# Altium project RCB_RP2040_WWVB.PrjPcb
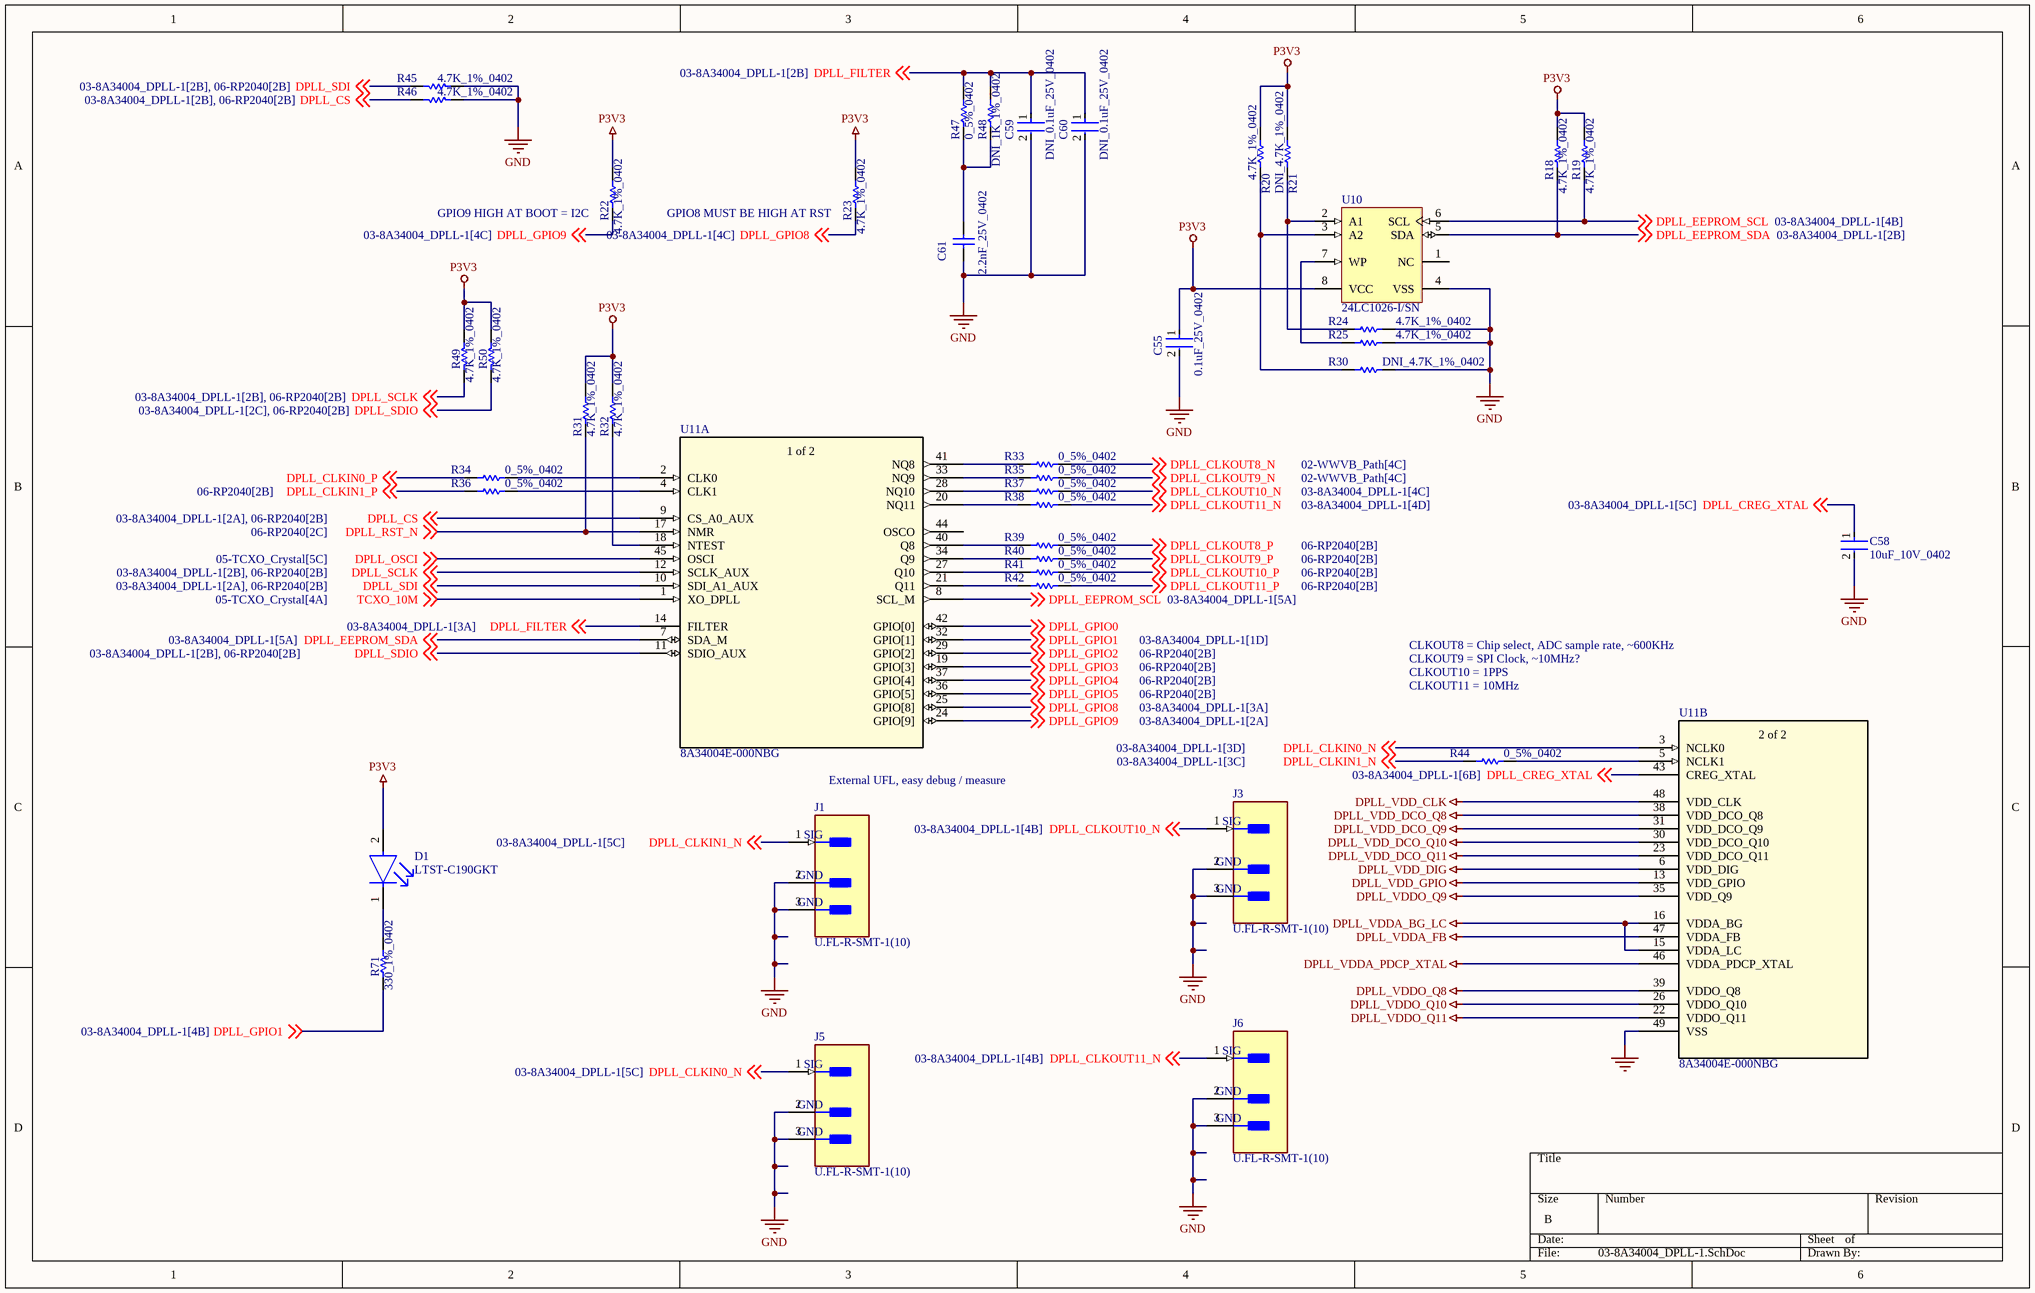
[diagram p0: 03-8A34004_DPLL-1.SchDoc]
prjCompanyName: Meta Platforms Technologies, LLC.; prjContactAddress1: 9845 Willows Road NE; prjContactAddress2: Redmond, WA 98052; prjContactEmail: Contact Email; prjContactPhone: (...)-...-....; prjElectricalEngineer: Electical Engineer; prjElectricalEngineerEmail: Electical Engineer Email; prjLayoutEngineer: Layout Engineer; prjLayoutEngineerEmail: Layout Engineer Email; prjMechanicalEngineer: Mechanical Engineer; prjMechanicalEngineerEmail: Mechanical Engineer Email; prjPCB_IPN: 844-XXXXX-XX; prjPCB_Name: PCB Name; prjPCB_Revision: X1; prjProjectName: Project Name; prjSchematic_IPN: 846-XXXXX-XX; prjSchematic_Revision: X1; XprjPCBA_IPN: Set v_prjPCBA_IPN in variant parameters; XprjPCBA_Revision: Set v_prjPCBA_Revision in variant parameters
4 sheets, 122 parts. Net scope: global (net labels, ports and power ports of the same name join across sheets).
Board file: RCB_RP2040_WWVB_V1.PcbDoc
Sheets:
  03-8A34004_DPLL-1.SchDoc
  05-TCXO_Crystal.SchDoc
  06-RP2040.SchDoc
  08-Power.SchDoc

## Sheet 03-8A34004_DPLL-1.SchDoc
size B; SheetNumber: 3; SheetTotal: 8

### Parts
C55  0.1uF_25V_0402  [FP-0402-L_1_0_1-W_0_5_0_1-IPC_C]
C58  10uF_10V_0402  [FP-CL05A106MP5NUNC-MFG]
C59  DNI_0.1uF_25V_0402  [FP-0402-L_1_0_1-W_0_5_0_1-IPC_C]  (no BOM)
C60  DNI_0.1uF_25V_0402  [FP-0402-L_1_0_1-W_0_5_0_1-IPC_C]  (no BOM)
C61  2.2nF_25V_0402  [CAPC1005X56X25LL10T15]
D1  LTST-C190GKT  [FP-LTST-C190GKT-MFG]
J1  U.FL-R-SMT-1(10)  [FP-U_FL-R-SMT-1_10-MFG]
J3  U.FL-R-SMT-1(10)  [FP-U_FL-R-SMT-1_10-MFG]
J5  U.FL-R-SMT-1(10)  [FP-U_FL-R-SMT-1_10-MFG]
J6  U.FL-R-SMT-1(10)  [FP-U_FL-R-SMT-1_10-MFG]
R18  4.7K_1%_0402  [RESC1005X40X25NL10T10]
R19  4.7K_1%_0402  [RESC1005X40X25NL10T10]
R20  4.7K_1%_0402  [RESC1005X40X25NL10T10]
R21  DNI_4.7K_1%_0402  [RESC1005X40X25NL10T10]  (no BOM)
R22  4.7K_1%_0402  [RESC1005X40X25NL10T10]
R23  4.7K_1%_0402  [RESC1005X40X25NL10T10]
R24  4.7K_1%_0402  [RESC1005X40X25NL10T10]
R25  4.7K_1%_0402  [RESC1005X40X25NL10T10]
R30  DNI_4.7K_1%_0402  [RESC1005X40X25NL10T10]  (no BOM)
R31  4.7K_1%_0402  [RESC1005X40X25NL10T10]
R32  4.7K_1%_0402  [RESC1005X40X25NL10T10]
R33  0_5%_0402  [RESC1005X40X25NL05T10]
R34  0_5%_0402  [RESC1005X40X25NL05T10]
R35  0_5%_0402  [RESC1005X40X25NL05T10]
R36  0_5%_0402  [RESC1005X40X25NL05T10]
R37  0_5%_0402  [RESC1005X40X25NL05T10]
R38  0_5%_0402  [RESC1005X40X25NL05T10]
R39  0_5%_0402  [RESC1005X40X25NL05T10]
R40  0_5%_0402  [RESC1005X40X25NL05T10]
R41  0_5%_0402  [RESC1005X40X25NL05T10]
R42  0_5%_0402  [RESC1005X40X25NL05T10]
R44  0_5%_0402  [RESC1005X40X25NL05T10]
R45  4.7K_1%_0402  [RESC1005X40X25NL10T10]
R46  4.7K_1%_0402  [RESC1005X40X25NL10T10]
R47  0_5%_0402  [RESC1005X40X25LL10T10]
R48  DNI_1K_1%_0402  [RESC1005X40X25NL05T05]  (no BOM)
R49  4.7K_1%_0402  [RESC1005X40X25NL10T10]
R50  4.7K_1%_0402  [RESC1005X40X25NL10T10]
R71  330_1%_0402  [RESC1005X40X25NL10T10]
U10  24LC1026-I/SN  [MCHP-SOIC-SN8_N]
U11  8A34004E-000NBG  [NBG48P1_REN]  (parts A,B of 2)

### Nets
DPLL_VDD_CLK: U11.48(VDD_CLK)
DPLL_VDD_DCO_Q8: U11.38(VDD_DCO_Q8)
DPLL_VDD_DCO_Q9: U11.31(VDD_DCO_Q9)
DPLL_VDD_DCO_Q10: U11.30(VDD_DCO_Q10)
DPLL_VDD_DCO_Q11: U11.23(VDD_DCO_Q11)
DPLL_VDD_DIG: U11.6(VDD_DIG)
DPLL_VDD_GPIO: U11.13(VDD_GPIO)
DPLL_VDDA_BG_LC: U11.15(VDDA_LC) U11.16(VDDA_BG)
DPLL_VDDA_FB: U11.47(VDDA_FB)
DPLL_VDDA_PDCP_XTAL: U11.46(VDDA_PDCP_XTAL)
DPLL_VDDO_Q8: U11.39(VDDO_Q8)
DPLL_VDDO_Q9: U11.35(VDD_Q9)
DPLL_VDDO_Q10: U11.26(VDDO_Q10)
DPLL_VDDO_Q11: U11.22(VDDO_Q11)
GND: C55.2 C58.2 C59.2 C60.2 C61.1 J1.2(GND) J1.3(GND) J3.2(GND) J3.3(GND) J5.2(GND) J5.3(GND) J6.2(GND) J6.3(GND) R24.1 R25.1 R30.2 R45.2 R46.2 U10.4(VSS) U11.49(VSS)
P3V3: C55.1 D1.2(A) R18.1 R19.1 R20.2 R21.2 R22.1 R23.1 R31.2 R32.2 R49.2 R50.2 U10.8(VCC)
DPLL_CLKIN0_N: J5.1(SIG) U11.3(NCLK0) ; off-sheet DPLL_CLKIN0_N
DPLL_CLKIN0_P: R34.1 ; off-sheet DPLL_CLKIN0_P
DPLL_CLKIN1_N: J1.1(SIG) R44.1 ; off-sheet DPLL_CLKIN1_N
DPLL_CLKIN1_P: R36.1 ; off-sheet DPLL_CLKIN1_P
DPLL_CLKOUT8_N: R33.2 ; off-sheet DPLL_CLKOUT8_N
DPLL_CLKOUT8_P: R39.2 ; off-sheet DPLL_CLKOUT8_P
DPLL_CLKOUT9_N: R35.2 ; off-sheet DPLL_CLKOUT9_N
DPLL_CLKOUT9_P: R40.2 ; off-sheet DPLL_CLKOUT9_P
DPLL_CLKOUT10_N: J3.1(SIG) R37.2 ; off-sheet DPLL_CLKOUT10_N
DPLL_CLKOUT10_P: R41.2 ; off-sheet DPLL_CLKOUT10_P
DPLL_CLKOUT11_N: J6.1(SIG) R38.2 ; off-sheet DPLL_CLKOUT11_N
DPLL_CLKOUT11_P: R42.2 ; off-sheet DPLL_CLKOUT11_P
DPLL_CREG_XTAL: C58.1 U11.43(CREG_XTAL) ; off-sheet DPLL_CREG_XTAL
DPLL_CS: R46.1 U11.9(CS_A0_AUX) ; off-sheet DPLL_CS
DPLL_EEPROM_SCL: R19.2 U10.6(SCL) U11.8(SCL_M) ; off-sheet DPLL_EEPROM_SCL
DPLL_EEPROM_SDA: R18.2 U10.5(SDA) U11.7(SDA_M) ; off-sheet DPLL_EEPROM_SDA
DPLL_FILTER: C59.1 C60.1 R47.2 R48.2 U11.14(FILTER) ; off-sheet DPLL_FILTER
DPLL_GPIO0: U11.42(GPIO[0]) ; off-sheet DPLL_GPIO0
DPLL_GPIO1: R71.1 U11.32(GPIO[1]) ; off-sheet DPLL_GPIO1
DPLL_GPIO2: U11.29(GPIO[2]) ; off-sheet DPLL_GPIO2
DPLL_GPIO3: U11.19(GPIO[3]) ; off-sheet DPLL_GPIO3
DPLL_GPIO4: U11.37(GPIO[4]) ; off-sheet DPLL_GPIO4
DPLL_GPIO5: U11.36(GPIO[5]) ; off-sheet DPLL_GPIO5
DPLL_GPIO8: R23.2 U11.25(GPIO[8]) ; off-sheet DPLL_GPIO8
DPLL_GPIO9: R22.2 U11.24(GPIO[9]) ; off-sheet DPLL_GPIO9
DPLL_OSCI: U11.45(OSCI) ; off-sheet DPLL_OSCI
DPLL_RST_N: R31.1 U11.17(NMR) ; off-sheet DPLL_RST_N
DPLL_SCLK: R49.1 U11.12(SCLK_AUX) ; off-sheet DPLL_SCLK
DPLL_SDI: R45.1 U11.10(SDI_A1_AUX) ; off-sheet DPLL_SDI
DPLL_SDIO: R50.1 U11.11(SDIO_AUX) ; off-sheet DPLL_SDIO
TCXO_10M: U11.1(XO_DPLL) ; off-sheet TCXO_10M
NetC61_2: C61.2 R47.1 R48.1
NetD1_1: D1.1(C) R71.2
NetR20_1: R20.1 R30.1 U10.3(A2)
NetR21_1: R21.1 R24.2 U10.2(A1)
NetR25_2: R25.2 U10.7(WP)
NetR32_1: R32.1 U11.18(NTEST)
NetR33_1: R33.1 U11.41(NQ8)
NetR34_2: R34.2 U11.2(CLK0)
NetR35_1: R35.1 U11.33(NQ9)
NetR36_2: R36.2 U11.4(CLK1)
NetR37_1: R37.1 U11.28(NQ10)
NetR38_1: R38.1 U11.20(NQ11)
NetR39_1: R39.1 U11.40(Q8)
NetR40_1: R40.1 U11.34(Q9)
NetR41_1: R41.1 U11.27(Q10)
NetR42_1: R42.1 U11.21(Q11)
NetR44_2: R44.2 U11.5(NCLK1)

Not connected (* = marked no-connect by the designer): U10 1(NC); U11 44(OSCO)

### Notes on the sheet
- (near R22) GPIO9 HIGH AT BOOT = I2C
- GPIO8 MUST BE HIGH AT RST
- CLKOUT8 = Chip select, ADC sample rate, ~600KHz
- CLKOUT9 = SPI Clock, ~10MHz?
- CLKOUT10 = 1PPS
- CLKOUT11 = 10MHz
- External UFL, easy debug / measure
- (in symbol 8A34004E-000NBG, part A) 1 of 2
- (in symbol 8A34004E-000NBG, part B) 2 of 2

### Library data of the parts
C55 C59 C60 = CMP-2008-02519-2: General Purpose Ceramic Capacitor, 0402, 100nF, 10%, X7R, 15%, 25V; Package Quantity: 1; Capacitance: 100nF; Min Operating Temperature: -55°C; Voltage: 25V; Voltage Rating: 25V; Construction: Flat; Max Operating Temperature: 125°C; Radiation Hardening: No; Depth: 0.5mm; Thickness: 0.022inch; Voltage Rating (DC): 25V; Number of Pins: 2; Lead Free: Lead Free; Series: -; REACH SVHC: No SVHC; Length: 1mm; Dielectric: X7R; RoHS Compliant: Yes; Mount: Surface Mount; Packaging: Tape and Reel; Case/Package: 0402; Case Code (Imperial): 0402; Termination: SMD/SMT; Width: 0.02inch; Case Code (Metric): 1005; Tolerance: 10%
C58 = CMP-13271-000002-1: CAP CER 10UF 10V X5R 0402; Manufacturer Part Number: CL05A106MP5NUNC; Manufacturer: Samsung; Temperature Coefficient: 15%; Tolerance: 20%; Material: Ceramic; Octopart: https://octopart.com/cl05a106mp5nunc-samsung-22457395; Voltage Rating: 10V; RoHS: TRUE; Value: 10uF; Height: 0.7mm; Digikey Description: CAP CER 10UF 10V X5R 0402; Automotive: No; Package: CL05A106MP5NUNC; Device Class L1: Passive Components; Capacitance: 10uF; Temperature Range High: +85°C; ComponentLink2Description: Datasheet; Device Class L2: Capacitors; Temperature Characteristic: X5R; Temperature: -55°C to +85°C; ComponentLink2URL: http://www.samsungsem.com/kr/support/product-search/mlcc/__icsFiles/afieldfile/2019/05/10/19-CL05A106MP5NUNC.pdf; Device Class L3: Ceramic Capacitors; Category: Cap; Temperature Range Low: -55°C; Ipc Land Pattern Name: CAPC10050X50; Lead Free: Yes
C61 = CMP-2008-02907-1: Manufacturer: AVX Interconnect / Elco; Part Number: 04025C222JAT2A
D1 = CMP-22017-000005-2: LED GREEN CLEAR CHIP SMD; Dominant Wavelength: 569nm; Reverse Voltage: 5V; Lens Color: Colorless; Viewing Angle: 130°; Voltage: 2V; Forward Current: 30mA; Power Dissipation: 100mW; Luminous Intensity: 6mcd; Number of LEDs: 1; Forward Voltage: 2.1V; Wavelength: 565nm; Test Current: 10mA; Min Operating Temperature: -55°C; Lens Style: Clear; Mount: Surface Mount; Width: 0.8mm; Packaging: Tape and Reel; Lens Transparency: Clear; Case Code (Metric): 1608; Depth: 0.8mm; Case Code (Imperial): 0603; Case/Package: 0603; Number of Pins: 2; Max Operating Temperature: 85°C; Lead Free: Lead Free; Number of Elements: 1; Length: 1.6mm; Height: 0.8mm; Package Quantity: 1; Power Rating: 100mW; Radiation Hardening: No; Illumination Color: Green; Color: Green
J1 J3 J5 J6 = CMP-2000-05152-3: CONN U.FL RCPT STR 50 OHM SMD; Max Frequency: 6GHz; Connector Type: Coaxial; Body Plating: Silver; Body Material: Bronze; Impedance: 50R; Dielectric Material: Polymer; Insulation Resistance: 500MR; Gender: Male; Packaging: Cut Tape; Length: 3mm; Package Quantity: 2500; Termination: Solder; Lead Free: Lead Free; Series: U.FL; Min Operating Temperature: -40°C; Fastening Type: Snap; Contact Material: Brass; Orientation: Straight; Wire/Cable Type: Coaxial; Frequency: 6GHz; Contact Plating: Gold; Depth: 3.1mm; Weight: 0.001764oz; Max Operating Temperature: 90°C; Radiation Hardening: No; REACH SVHC: No SVHC; Mount: Surface Mount; Housing Color: Beige
R18-R25 R30-R32 R45 R46 R49 R50 = CMP-2002-05217-1: Manufacturer: Bourns; Part Number: CR0402-FX-4701GLF
R33-R42 R44 = CMP-2002-06457-1: Manufacturer: Panasonic; Part Number: ERJ-U020R00X
R47 = CMP-2002-04569-1: Manufacturer: KOA Speer; Part Number: RK73Z1ETTP
R48 = CMP-2002-08277-1: Manufacturer: Vishay Dale; Part Number: CRCW04021K00FKTD
R71 = CMP-2002-05853-1: Manufacturer: Panasonic; Part Number: ERA-2AED331X
U10 = CMP-0159-01024-1: 1024K bits I2C™ Serial EEPROM, 2.5 to 5.5 V, 400 kHz, -40 to 85 degC, 8-pin SOIC (SN8), Tube; Manufacturer: Microchip; DatasheetVersion: Rev. C; ComponentLink3Description: Package Specification; ComponentLink1URL: http://www.microchip.com; Mounting Technology: Surface Mount; ComponentLink4URL: http://www.microchip.com/24LC1026; ComponentLink2Description: Datasheet; PartNumber: 24LC1026-I/SN; PackageReference: SOIC-SN8; PackageDescription: 8-Lead Plastic Small Outline, 4.9 x 3.9 mm Body, 1.27 mm Pitch; ComponentLink1Description: Manufacturer URL; ComponentLink3URL: http://www.microchip.com/stellent/groups/techpub_sg/documents/packagingspec/en012702.pdf; ComponentLink2URL: http://ww1.microchip.com/downloads/en/DeviceDoc/22270C.pdf; PackageVersion: C04-057C; ComponentLink4Description: Product URL
U11 = 8A34004E-000NBG: No Description Available; Mfr_Name: Renesas Electronics; RefDes: RefDes; Type: Type

## Sheet 05-TCXO_Crystal.SchDoc
size B; SheetNumber: 4; SheetTotal: 7
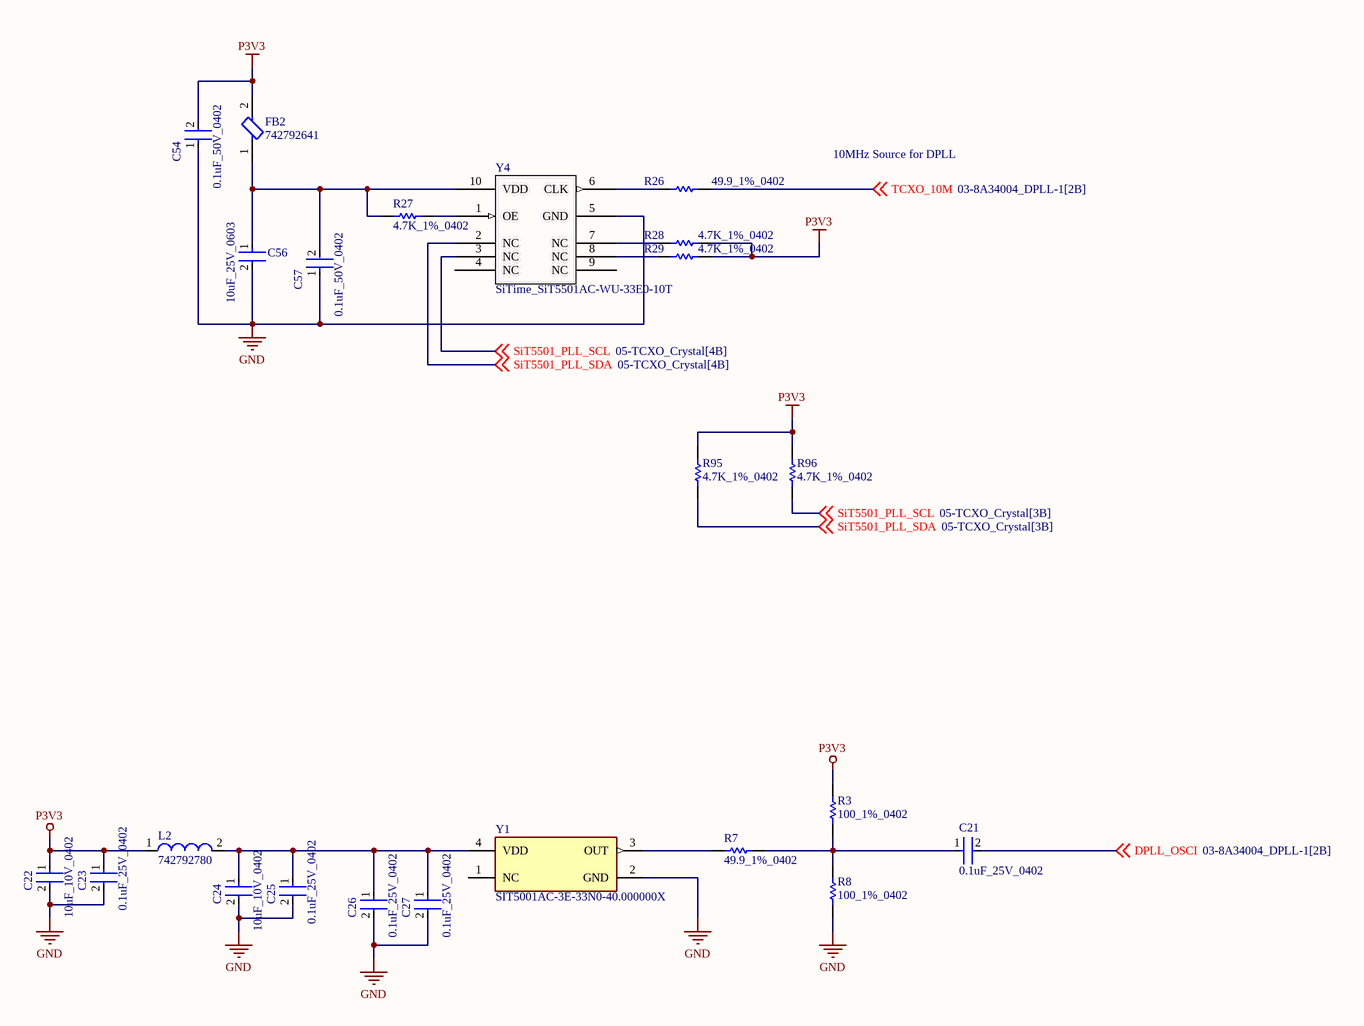
[diagram p1: 05-TCXO_Crystal.SchDoc]

### Parts
C21  0.1uF_25V_0402  [FP-0402-L_1_0_1-W_0_5_0_1-IPC_C]
C22  10uF_10V_0402  [FP-CL05A106MP5NUNC-MFG]
C23  0.1uF_25V_0402  [FP-0402-L_1_0_1-W_0_5_0_1-IPC_C]
C24  10uF_10V_0402  [FP-CL05A106MP5NUNC-MFG]
C25  0.1uF_25V_0402  [FP-0402-L_1_0_1-W_0_5_0_1-IPC_C]
C26  0.1uF_25V_0402  [FP-0402-L_1_0_1-W_0_5_0_1-IPC_C]
C27  0.1uF_25V_0402  [FP-0402-L_1_0_1-W_0_5_0_1-IPC_C]
C54  0.1uF_50V_0402  [FP-C1005-050-0_05-IPC_C]
C56  10uF_25V_0603  [FP-CL10-IPC_C]
C57  0.1uF_50V_0402  [FP-C1005-050-0_05-IPC_C]
FB2  742792641  [FP-742792641-MFG]
L2  742792780  [SMD-0402]
R3  100_1%_0402  [RESC1005X40X25ML05T10]
R7  49.9_1%_0402  [RESC1005X40X25NL10T10]
R8  100_1%_0402  [RESC1005X40X25ML05T10]
R26  49.9_1%_0402  [RESC1005X40X25NL10T10]
R27  4.7K_1%_0402  [RESC1005X40X25NL10T10]
R28  4.7K_1%_0402  [RESC1005X40X25NL10T10]
R29  4.7K_1%_0402  [RESC1005X40X25NL10T10]
R95  4.7K_1%_0402  [RESC1005X40X25NL10T10]
R96  4.7K_1%_0402  [RESC1005X40X25NL10T10]
Y1  SIT5001AC-3E-33N0-40.000000X  [FP-SiT5001-3-MFG]
Y4  SiTime_SiT5501AC-WU-33E0-10T  [SITIME_SPL-086-CQFN-010-C07050_REV_DRAFT]

### Nets
GND: C22.2 C23.2 C24.2 C25.2 C26.2 C27.2 C54.1 C56.2 C57.1 R8.1 Y1.2(GND) Y4.5(GND)
P3V3: C22.1 C23.1 C54.2 FB2.2 L2.1 R3.2 R28.2 R29.2 R95.2 R96.2
DPLL_OSCI: C21.2 ; off-sheet DPLL_OSCI
SiT5501_PLL_SCL: R96.1 Y4.3(NC) ; off-sheet SiT5501_PLL_SCL
SiT5501_PLL_SDA: R95.1 Y4.2(NC) ; off-sheet SiT5501_PLL_SDA
TCXO_10M: R26.1 ; off-sheet TCXO_10M
NetC21_1: C21.1 R3.1 R7.2 R8.2
NetC24_1: C24.1 C25.1 C26.1 C27.1 L2.2 Y1.4(VDD)
NetC56_1: C56.1 C57.2 FB2.1 R27.1 Y4.10(VDD)
NetR7_1: R7.1 Y1.3(OUT)
NetR26_2: R26.2 Y4.6(CLK)
NetR27_2: R27.2 Y4.1(OE)
NetR28_1: R28.1 Y4.7(NC)
NetR29_1: R29.1 Y4.8(NC)

Not connected (* = marked no-connect by the designer): Y1 1(NC); Y4 4(NC) 9(NC)

### Notes on the sheet
- 10MHz Source for DPLL

### Library data of the parts
C21 C23 C25-C27 = CMP-2008-02519-2: as C55 on sheet 03-8A34004_DPLL-1; Package Quantity: 1; Capacitance: 100nF; Min Operating Temperature: -55°C; Voltage: 25V; Voltage Rating: 25V; Construction: Flat; Max Operating Temperature: 125°C; Radiation Hardening: No; Depth: 0.5mm; Thickness: 0.022inch; Voltage Rating (DC): 25V; Number of Pins: 2; Lead Free: Lead Free; Series: -; REACH SVHC: No SVHC; Length: 1mm; Dielectric: X7R; RoHS Compliant: Yes; Mount: Surface Mount; Packaging: Tape and Reel; Case/Package: 0402; Case Code (Imperial): 0402; Termination: SMD/SMT; Width: 0.02inch; Case Code (Metric): 1005; Tolerance: 10%
C22 C24 = CMP-13271-000002-1: as C58 on sheet 03-8A34004_DPLL-1; Octopart: https://octopart.com/cl05a106mp5nunc-samsung-22457395; Voltage Rating: 10V; RoHS: TRUE; Value: 10uF; Height: 0.7mm; Digikey Description: CAP CER 10UF 10V X5R 0402; Automotive: No; Package: CL05A106MP5NUNC; Device Class L1: Passive Components; Capacitance: 10uF; Temperature Range High: +85°C; ComponentLink2Description: Datasheet; Device Class L2: Capacitors; Temperature Characteristic: X5R; Temperature: -55°C to +85°C; ComponentLink2URL: http://www.samsungsem.com/kr/support/product-search/mlcc/__icsFiles/afieldfile/2019/05/10/19-CL05A106MP5NUNC.pdf; Device Class L3: Ceramic Capacitors; Category: Cap; Temperature Range Low: -55°C; Ipc Land Pattern Name: CAPC10050X50; Lead Free: Yes
C54 C57 = CMP-2000-05393-2: Multilayer Ceramic Capacitors 100nF ±10% 50V X7R SMD 0402; Voltage: 50V; Dielectric Material: Ceramic; Min Operating Temperature: -55°C; Depth: 0.5mm; Radiation Hardening: No; RoHS Compliant: Yes; Voltage Rating (DC): 50V; Lead Free: Lead Free; Resistor Type: Ceramic; Height: 0.5mm; Dielectric: X7R; Thickness: 0.022inch; Case/Package: 0402; Case Code (Metric): 1005; Termination: SMD/SMT; Capacitance: 100nF; Packaging: Tape and Reel; Max Operating Temperature: 125°C; Mount: Surface Mount; Package Quantity: 1; Width: 0.02inch; Weight: 2.3E-05oz; Voltage Rating: 50V; Tolerance: 10%; Construction: Flat; Case Code (Imperial): 0402; Length: 1mm; REACH SVHC: No SVHC; Series: C
C56 = CMP-13271-004224-1: Cap Ceramic 10uF 25V X5R ±20% Pad SMD 0603 +85°C T/R; Width: 0.031inch; Voltage Rating: 25V; Length: 0.063inch; Case Code (Metric): 1608; Dielectric: X5R; Termination: Wraparound; Capacitance: 10uF; Lead Free: Lead Free; Mount: Surface Mount; Package Quantity: 1; Case Code (Imperial): 0603; Thickness: 0.035inch; Packaging: Tape and Reel; Contact Plating: Tin; Min Operating Temperature: -55°C; Tolerance: 20%; Max Operating Temperature: 85°C; Case/Package: 0603
FB2 = CMP-0220-00171-2: FERRITE BEAD 300 OHM 0603 1LN; Inductance: 18nH; Max DC Current: 2A; Number of Lines: 1; Test Frequency: 100MHz; Impedance: 300R; DC Resistance (DCR): 150mR; Tolerance: 25%; Case Code (Metric): 1608; Core Material: Ferrite; Length: 1.6mm; Lead Free: Lead Free; Series: WE-CBF; Min Operating Temperature: -55°C; RoHS Compliant: Yes; Case/Package: SMD/SMT; Material: Ferrite; Max Operating Temperature: 125°C; Termination: SMD/SMT; Packaging: Tape and Reel; Weight: 0.000141oz; Case Code (Imperial): 0603; Width: 0.8mm; Mount: Surface Mount; Max Current Rating: 2A; Package Quantity: 1; Depth: 0.8mm; Current Rating: 2A; Height: 0.8mm
L2 = CMP-0220-00137-1: SMD EMI Suppression Ferrite Bead WE-CBF, Z = 220 Ohm; Impedance: 220 Ohm; PackageVersion: 2009; DatasheetVersion: ver 4, Jul-2009; PackageDescription: Chip Inductor, 2-Leads, Body 1.0 x 0.5 mm; ComponentLink1URL: http://www.we-online.com; ComponentLink1Description: Manufacturer Link; ComponentLink2URL: http://www.we-online.de/katalog/media/pdf/742792780.pdf; PackageReference: SMD-0402; ComponentLink2Description: Datasheet
R3 R8 = CMP-2002-06458-1: Part Number: ERJ-U02F1000X; Manufacturer: Panasonic
R7 R26 = CMP-2002-04448-1: Part Number: RK73H1ETTP49R9F; Manufacturer: KOA Speer
R27-R29 R95 R96 = CMP-2002-05217-1: as R18 on sheet 03-8A34004_DPLL-1
Y1 = CMP-25159-259584-1: MEMS OSC TCXO 40.0000MHZ LVCMOS; Frequency Stability: 5ppm; Max Supply Current: 33mA; Frequency: 40MHz; Case/Package: SMD/SMT; Packaging: Cut Tape; Min Operating Temperature: -20°C; Mount: Surface Mount; Length: 0.197inch; Series: SiT5001; Max Operating Temperature: 70°C; Height: 0.031inch; Width: 0.126inch
Y4 = CMP-OSC-00029-2: OSC, MEMS, STRATUM 3E, 10.000MHZ, 10PPB STAB, LVCMOS, 3.3V, O/P EN, 7.0X5.0X2.2MM, CQFN-10; Manufacturer Part Number: SiT5501AI-WU033JH-10.000000; Manufacturer: SiTime; Frequency: 10 MHz; Voltage - Supply: 3.3 V; Type: OCXO; Category: Oscillators; Max Operating Temperature: 70°C; Min Operating Temperature: -20°C; Height: 2.20mm (max); Case/Package: 10 Lead QFN; Output: LVCMOS; Mounting Type: Surface Mount; Frequency Stability: ±10 ppb; RoHS: Yes

## Sheet 06-RP2040.SchDoc
size B; SheetNumber: 6; SheetTotal: 8
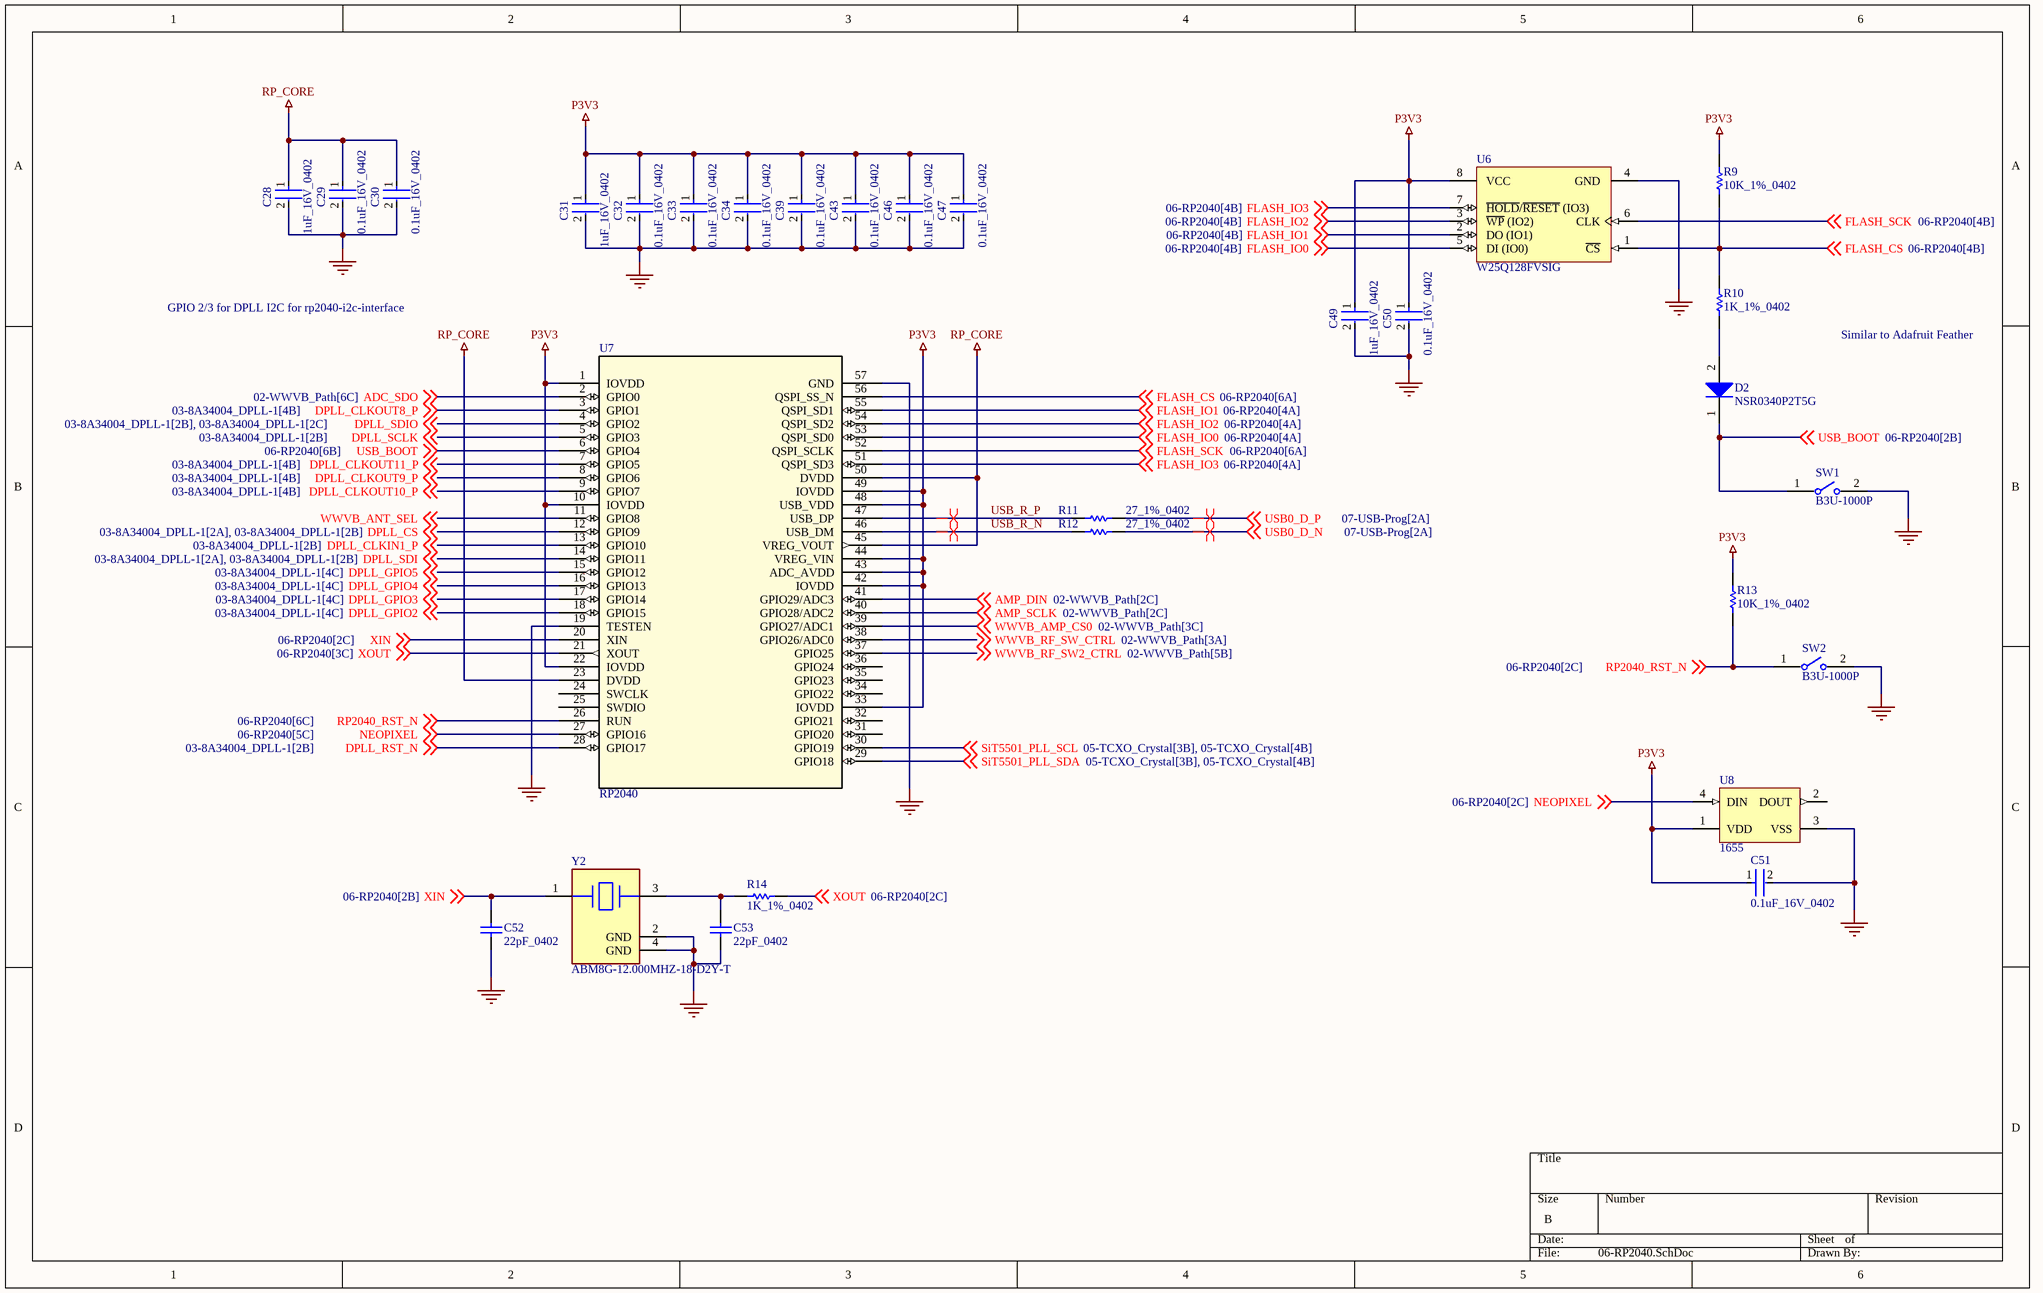
[diagram p2: 06-RP2040.SchDoc]

### Parts
C28  1uF_16V_0402  [FP-0402-L_1_0_0_05-W_0_5-IPC_A]
C29  0.1uF_16V_0402  [FP-C0402-BB-MFG]
C30  0.1uF_16V_0402  [FP-C0402-BB-MFG]
C31  1uF_16V_0402  [FP-0402-L_1_0_0_05-W_0_5-IPC_A]
C32  0.1uF_16V_0402  [FP-C0402-BB-MFG]
C33  0.1uF_16V_0402  [FP-C0402-BB-MFG]
C34  0.1uF_16V_0402  [FP-C0402-BB-MFG]
C39  0.1uF_16V_0402  [FP-C0402-BB-MFG]
C43  0.1uF_16V_0402  [FP-C0402-BB-MFG]
C46  0.1uF_16V_0402  [FP-C0402-BB-MFG]
C47  0.1uF_16V_0402  [FP-C0402-BB-MFG]
C49  1uF_16V_0402  [FP-0402-L_1_0_0_05-W_0_5-IPC_A]
C50  0.1uF_16V_0402  [FP-C0402-BB-MFG]
C51  0.1uF_16V_0402  [FP-C0402-BB-MFG]
C52  22pF_0402  [CAPC1005X55X25ML05T05]
C53  22pF_0402  [CAPC1005X55X25ML05T05]
D2  NSR0340P2T5G  [ONSC-SOD-923-2-514AB-01_B_V]
R9  10K_1%_0402  [RESC1005X40X25NL10T10]
R10  1K_1%_0402  [RESC1005X40X25LL10T10]
R11  27_1%_0402  [RESC1005X40X25LL05T10]
R12  27_1%_0402  [RESC1005X40X25LL05T10]
R13  10K_1%_0402  [RESC1005X40X25NL10T10]
R14  1K_1%_0402  [RESC1005X40X25LL10T10]
SW1  B3U-1000P  [FP-B3U-1000P-MFG]
SW2  B3U-1000P  [FP-B3U-1000P-MFG]
U6  W25Q128FVSIG  [WINB-SOIC-8_M]
U7  RP2040  [IC57_RP2040]
U8  1655  [ADA-RGB-1655_V]
Y2  ABM8G-12.000MHZ-18-D2Y-T  [FP-ABM8G-MFG]

### Nets
GND: C28.2 C29.2 C30.2 C31.2 C32.2 C33.2 C34.2 C39.2 C43.2 C46.2 C47.2 C49.2 C50.2 C51.2 C52.1 C53.1 SW1.2 SW2.2 U6.4(GND) U7.19(TESTEN) U7.57(GND) U8.3(VSS) Y2.2(GND) Y2.4(GND)
P3V3: C31.1 C32.1 C33.1 C34.1 C39.1 C43.1 C46.1 C47.1 C49.1 C50.1 C51.1 R9.1 R13.1 U6.8(VCC) U7.1(IOVDD) U7.10(IOVDD) U7.22(IOVDD) U7.33(IOVDD) U7.42(IOVDD) U7.43(ADC_AVDD) U7.44(VREG_VIN) U7.48(USB_VDD) U7.49(IOVDD) U8.1(VDD)
RP_CORE: C28.1 C29.1 C30.1 U7.23(DVDD) U7.45(VREG_VOUT) U7.50(DVDD)
ADC_SDO: U7.2(GPIO0) ; off-sheet ADC_SDO
AMP_DIN: U7.41(GPIO29/ADC3) ; off-sheet AMP_DIN
AMP_SCLK: U7.40(GPIO28/ADC2) ; off-sheet AMP_SCLK
DPLL_CLKIN1_P: U7.13(GPIO10) ; off-sheet DPLL_CLKIN1_P
DPLL_CLKOUT8_P: U7.3(GPIO1) ; off-sheet DPLL_CLKOUT8_P
DPLL_CLKOUT9_P: U7.8(GPIO6) ; off-sheet DPLL_CLKOUT9_P
DPLL_CLKOUT10_P: U7.9(GPIO7) ; off-sheet DPLL_CLKOUT10_P
DPLL_CLKOUT11_P: U7.7(GPIO5) ; off-sheet DPLL_CLKOUT11_P
DPLL_CS: U7.12(GPIO9) ; off-sheet DPLL_CS
DPLL_GPIO2: U7.18(GPIO15) ; off-sheet DPLL_GPIO2
DPLL_GPIO3: U7.17(GPIO14) ; off-sheet DPLL_GPIO3
DPLL_GPIO4: U7.16(GPIO13) ; off-sheet DPLL_GPIO4
DPLL_GPIO5: U7.15(GPIO12) ; off-sheet DPLL_GPIO5
DPLL_RST_N: U7.28(GPIO17) ; off-sheet DPLL_RST_N
DPLL_SCLK: U7.5(GPIO3) ; off-sheet DPLL_SCLK
DPLL_SDI: U7.14(GPIO11) ; off-sheet DPLL_SDI
DPLL_SDIO: U7.4(GPIO2) ; off-sheet DPLL_SDIO
FLASH_CS: R9.2 R10.2 U6.1(~{CS}) U7.56(QSPI_SS_N) ; off-sheet FLASH_CS
FLASH_IO0: U6.5(DI_(IO0)) U7.53(QSPI_SD0) ; off-sheet FLASH_IO0
FLASH_IO1: U6.2(DO_(IO1)) U7.55(QSPI_SD1) ; off-sheet FLASH_IO1
FLASH_IO2: U6.3(~{WP}_(IO2)) U7.54(QSPI_SD2) ; off-sheet FLASH_IO2
FLASH_IO3: U6.7(~{HOLD}/~{RESET}_(IO3)) U7.51(QSPI_SD3) ; off-sheet FLASH_IO3
FLASH_SCK: U6.6(CLK) U7.52(QSPI_SCLK) ; off-sheet FLASH_SCK
NEOPIXEL: U7.27(GPIO16) U8.4(DIN) ; off-sheet NEOPIXEL
RP2040_RST_N: R13.2 SW2.1 U7.26(RUN) ; off-sheet RP2040_RST_N
SiT5501_PLL_SCL: U7.30(GPIO19) ; off-sheet SiT5501_PLL_SCL
SiT5501_PLL_SDA: U7.29(GPIO18) ; off-sheet SiT5501_PLL_SDA
USB0_D_N: R12.2 ; off-sheet USB0_D_N
USB0_D_P: R11.2 ; off-sheet USB0_D_P
USB_BOOT: D2.1(K) SW1.1 U7.6(GPIO4) ; off-sheet USB_BOOT
USB_R_N: R12.1 U7.46(USB_DM)
USB_R_P: R11.1 U7.47(USB_DP)
WWVB_AMP_CS0: U7.39(GPIO27/ADC1) ; off-sheet WWVB_AMP_CS0
WWVB_ANT_SEL: U7.11(GPIO8) ; off-sheet WWVB_ANT_SEL
WWVB_RF_SW2_CTRL: U7.37(GPIO25) ; off-sheet WWVB_RF_SW2_CTRL
WWVB_RF_SW_CTRL: U7.38(GPIO26/ADC0) ; off-sheet WWVB_RF_SW_CTRL
XIN: C52.2 U7.20(XIN) Y2.1 ; off-sheet XIN
XOUT: R14.2 U7.21(XOUT) ; off-sheet XOUT
NetC53_2: C53.2 R14.1 Y2.3
NetD2_2: D2.2(A) R10.1

Not connected (* = marked no-connect by the designer): U7 24(SWCLK) 25(SWDIO) 31(GPIO20) 32(GPIO21) 34(GPIO22) 35(GPIO23) 36(GPIO24); U8 2(DOUT)

### Layout directives
differential pair: USB0_D_N, USB0_D_P, USB_R_N, USB_R_P

### Notes on the sheet
- GPIO 2/3 for DPLL I2C for rp2040-i2c-interface
- Similar to Adafruit Feather

### Library data of the parts
C28 C31 C49 = CMP-14477-000104-2: None; Tolerance: 10%; Voltage Rating: 16V; Dielectric: X5R; Capacitance: 1uF; Packaging: Tape and Reel; Depth: 0.5mm; Mount: Surface Mount; Thickness: 0.022inch; Package Quantity: 1; Min Operating Temperature: -55°C; Series: M; Voltage Rating (DC): 16V; Termination: SMD/SMT; Case/Package: 0402; Number of Pins: 2; Case Code (Imperial): 0402; Length: 1mm; Halogen Free: Halogen Free; Case Code (Metric): 1005; Width: 0.02inch; RoHS Compliant: Yes; Radiation Hardening: No; Max Operating Temperature: 85°C; Height: 0.5mm; Construction: Flat
C29 C30 C32-C34 C39 C43 C46 C47 C50 C51 = CMP-1034-02068-3: CAP CER 0.1UF 16V 5% X7R 0402; Manufacturer: Kemet; Manufacturer Part Number: C0402C104J4RACTU; Value: 0.10 μF; Temperature Coefficient: 15%; Tolerance: 0.05; Material: Ceramic; ComponentLink2URL: https://content.kemet.com/datasheets/KEM_C1002_X7R_SMD.pdf; Automotive: No; Device Class L2: Capacitors; Temperature: -55°C to +125°C; RoHS: TRUE; Voltage Rating: 16 V; ComponentLink2Description: Datasheet; Device Class L3: Ceramic Capacitors; Temperature Range Low: -55°C; Ipc Land Pattern Name: CAPC10050X50; Device Class L1: Passive Components; Temperature Range High: +125°C; Package: C0402-BB; Capacitance: 0.10 μF; Category: Cap; Mouser Description: CAP CER 0.1UF 16V X7R 0402; Height: 0.55mm; Digikey Description: CAP CER 0.1UF 16V 5% X7R 0402; Octopart: https://octopart.com/c0402c104j4ractu-kemet-12573893; Temperature Characteristic: X7R; Lead Free: Yes
C52 C53 = CMP-2100-03590-1: Chip Capacitor, 22 pF, +/- 5%, 50 V, -55 to 125 degC, 0402 (1005 Metric), RoHS, Tape and Reel; Manufacturer: Yageo; Voltage Rating: 50V; Dielectric Material: Ceramic; Capacitance: 22pF; Temperature Coefficient: 30ppm/degC; Dielectric: C0G; Insulation Resistance: 100GR; Datasheet URL: http://www.yageo.com/NewPortal/yageodocoutput?fileName=/pdf/MLCC/UPY-GP_NP0_16V-to-50V_14.pdf; Depth: 0.5mm; Number of Pins: 2; Height: 0.5mm; Min Operating Temperature: -55degC; REACH SVHC: NoSVHC; Max Operating Temperature: 125degC; Voltage Rating (DC): 50V; Composition: Ceramic; Packaging: TapeandReel; Package Quantity: 1; Package Reference: 0402; Length: 1mm; Radiation Hardening: No; Package Description: 2-Pin Surface Mount Device, Body 1 x 0.5 mm; RoHSCompliant: True; Thickness: 0.022inch; Manufacturer URL: http://www.yageo.com/; Mount: SurfaceMount; Case Code (Metric): 1005; Case/Package: 0402; Tolerance: 5%; Termination: SMD/SMT; Width: 0.02inch; Datasheet Version: Rev. 14, 07/2016; Lead Free: LeadFree; Case Code (Imperial): 0402
D2 = CMP-1055-00495-1: Schottky Barrier Diode, 2-Pin SOD-923, Pb-Free, Tape and Reel; Manufacturer: On Semiconductor; Configuration: Single; IFSM Max (A): 1; PackageReference: SOD-923-2-514AB-01_B; Mounting Technology: Surface Mount; ComponentLink2Description: Datasheet; ComponentLink2URL: http://www.onsemi.cn/pub_link/Collateral/NSR0340P2-D.PDF; DatasheetVersion: Rev. 0; ComponentLink1URL: http://www.onsemi.com/; PackageVersion: Rev. B; ComponentLink3URL: http://www.onsemi.cn/pub_link/Collateral/NSR0170P2-D.PDF; PackageDescription: 2-Pin SOD, Body 0.8 x 0.6 mm; PartNumber: NSR0340P2T5G; Packing: Tape and Reel; ComponentLink3Description: Package Specification; ComponentLink1Description: Manufacturer URL; RoHS: TRUE
R9 R13 = CMP-2002-04694-1: Manufacturer: Bourns; Part Number: CR0402-FX-1002GLF
R10 R14 = CMP-2002-04692-1: Part Number: CR0402-FX-1001GLF; Manufacturer: Bourns
R11 R12 = CMP-2002-07055-1: Part Number: RC0402FR-0727RL; Manufacturer: Yageo / Phycomp
SW1 SW2 = CMP-2100-03586-2: SWITCH TACTILE SPST-NO 0.05A 12V; Contact Resistance: 100mR; Operating Force: 1.5N; Max Current Rating: 50mA; Switch Travel: 0.15mm; Actuator Type: Standard; Mechanical Life: 200000Cycles; Ratings: Dust Proof; Illumination Type: Non-Illuminated; Throw Configuration: SPST; Actuator Length: 0.4mm; Switch Function: Off-Mom; Height: 1.2mm; Width: 3mm; Weight: 0.000776oz; Contact Material: Silver; Max Voltage Rating (DC): 12V; Insulation Resistance: 100MR; Lead Free: Lead Free; Current Rating: 50mA; Termination: SMD/SMT; Length: 4mm; Voltage Rating (DC): 12V; Contact Current Rating: 50mA; Orientation: Straight; Depth: 2.5mm; Max Operating Temperature: 70°C; Packaging: Tape and Reel; Min Operating Temperature: -25°C; Package Quantity: 1; Mount: Surface Mount; Electrical Life: 200000Cycles
U6 = CMP-2000-05005-1: 3V 128M-Bit Serial Flash Memory with Dual/Quad SPI & QPI, 2.7 to 3.6 V, -40 to 85 degC, 8-Pin SOIC, RoHS, Tape and Reel; Manufacturer: Winbond; Number of Words: 16777216; Address Bus: 24b; Word Size: 8b; Boot Type: NotRequired; Supply Current: 20mA; Operating Supply Voltage (Max): 3.6V; Sync/Async: Synchronous; Rad Hardened: No; Interface Type: Serial(SPI); Access Time (Max): 7ns; Operating Supply Voltage (Min): 2.7V; Operating Supply Voltage (Typ): 3/3.3V; Programmable: Yes; Density: 134217728Bit; Cell Type: NOR; Package Description: 8-Pin Small Outline Integrated Circuit, Body 5.28 x 5.28 mm, Pitch 1.27 mm; Datasheet URL: http://download.siliconexpert.com/pdfs/2015/11/30/6/42/17/890/win_/manual/3w25q128fv20rev.l2008242015.pdf; Package Reference: SS-8; Package Type: SOICW; Datasheet Version: Rev. L, 08/2015; Manufacturer URL: http://www.winbond.com/hq/index.html?__locale=en; Pin Count: 8; Operating Temperature Classification: Industrial; Operating Temperature (Min): -40C; Program/Erase Volt (Typ): 2.7to3.6V; Operating Temperature (Max): 85C; Mounting: SurfaceMount; Operating Temp Range: -40Cto85C
U7 = RP2040: No Description Available; Mfr_Name: Raspberry Pi; RefDes: RefDes; Type: Type
U8 = CMP-2000-05026-1: Intelligent Control LED Integrated Light Source, 3.5 to 5.3 V, -25 to 80 degC, 4-Pin SMD, RoHS, Tape and Reel; Manufacturer: Adafruit-Industries-LLC; Number of LEDs: 10; Configuration: Discrete; Utilized LED: WS2812(5050); Datasheet URL: http://datasheet.octopart.com/ADA1655-Adafruit-Industries-datasheet-32028139.pdf; Series: Neopixel; Interface: -; Package Description: 4-Pin Surface Mount Device, Body 5 x 5 mm; Color: Red,Green,Blue(RGB); Category: Optoelectronics; Controller Type: -; Package Reference: 1655; Manufacturer URL: https://www.adafruit.com/; Mounting Type: SurfaceMount; Datasheet Version: May-13; Size / Dimension: 5.00mmLx5.00mmW; Family: Addressable,Specialty
Y2 = CMP-2000-05039-3: Crystal 12MHz ±20ppm (Tol) ±30ppm (Stability) 18pF FUND 120Ω 4-Pin SMD T/R; Series Resistance: 120R; Max Operating Temperature: 85°C; Mount: Surface Mount; Width: 2.5mm; Series: ABM8G; Termination: SMD/SMT; Frequency Tolerance: 20ppm; Tolerance: 20ppm; Min Operating Temperature: -40°C; Operating Frequency: 12 MHz; Depth: 2.5mm; Load Capacitance: 18pF; Number of Pins: 4; Length: 3.2mm; Radiation Hardening: No; Frequency Stability: 30ppm; Height: 1mm; Packaging: Tape and Reel; Package Quantity: 1000; ESR (Equivalent Series Resistance): 120R; Lead Free: Lead Free; Frequency: 12MHz; Case/Package: CSMD

## Sheet 08-Power.SchDoc
size B; SheetNumber: 8; SheetTotal: 8
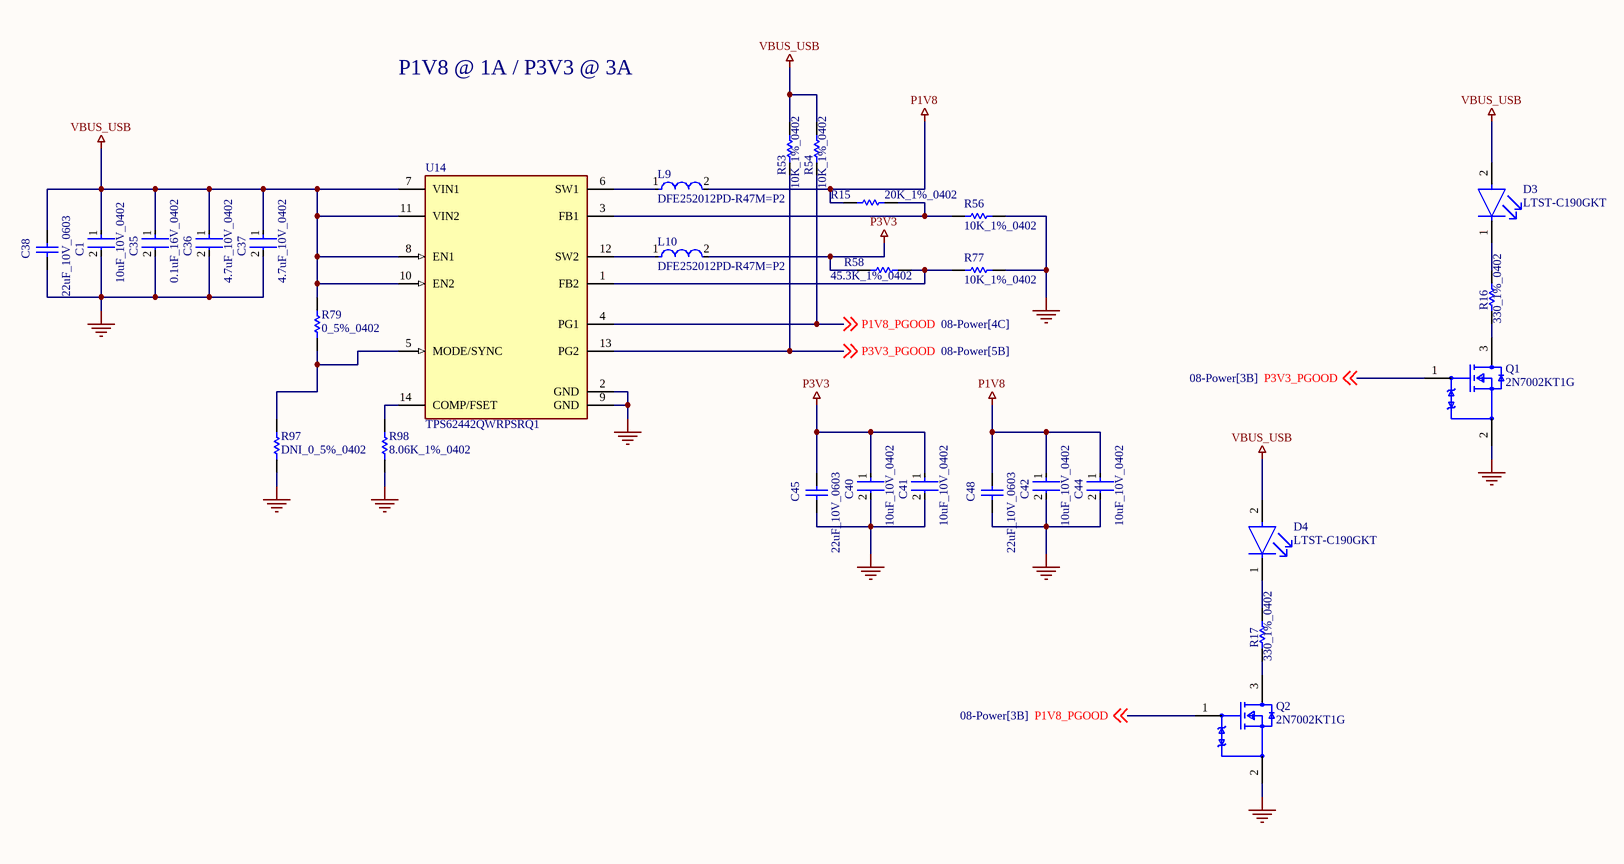
[diagram p3: 08-Power.SchDoc]

### Parts
C1  10uF_10V_0402  [FP-CL05A106MP5NUNC-MFG]
C35  0.1uF_16V_0402  [FP-C0402-BB-MFG]
C36  4.7uF_10V_0402  [FP-C1005-050-0_15-MFG]
C37  4.7uF_10V_0402  [FP-C1005-050-0_15-MFG]
C38  22uF_10V_0603  [CAPC1608X100X20ML10]
C40  10uF_10V_0402  [FP-CL05A106MP5NUNC-MFG]
C41  10uF_10V_0402  [FP-CL05A106MP5NUNC-MFG]
C42  10uF_10V_0402  [FP-CL05A106MP5NUNC-MFG]
C44  10uF_10V_0402  [FP-CL05A106MP5NUNC-MFG]
C45  22uF_10V_0603  [CAPC1608X100X20ML10]
C48  22uF_10V_0603  [CAPC1608X100X20ML10]
D3  LTST-C190GKT  [FP-LTST-C190GKT-MFG]
D4  LTST-C190GKT  [FP-LTST-C190GKT-MFG]
L9  DFE252012PD-R47M=P2  [FP-DFE252012C-IPC_A]
L10  DFE252012PD-R47M=P2  [FP-DFE252012C-IPC_A]
Q1  2N7002KT1G  [FP-318-08-MFG]
Q2  2N7002KT1G  [FP-318-08-MFG]
R15  20K_1%_0402  [RESC1005X40X25ML10T10]
R16  330_1%_0402  [RESC1005X40X25NL10T10]
R17  330_1%_0402  [RESC1005X40X25NL10T10]
R53  10K_1%_0402  [RESC1005X40X25NL10T10]
R54  10K_1%_0402  [RESC1005X40X25NL10T10]
R56  10K_1%_0402  [RESC1005X40X25NL10T10]
R58  45.3K_1%_0402  [RESC0402(1005)_L]
R77  10K_1%_0402  [RESC1005X40X25NL10T10]
R79  0_5%_0402  [RESC1005X40X25NL05T10]
R97  DNI_0_5%_0402  [RESC1005X40X25NL05T10]  (no BOM)
R98  8.06K_1%_0402  [RESC1005X40X25ML05T05]
U14  TPS62442QWRPSRQ1  [FP-RQR0014A-MFG]

### Nets
GND: C1.2 C35.2 C36.2 C37.2 C38.1 C40.2 C41.2 C42.2 C44.2 C45.1 C48.1 Q1.2(Source) Q2.2(Source) R56.1 R77.1 R97.1 R98.1 U14.2(GND) U14.9(GND)
P1V8: C42.1 C44.1 C48.2 L9.2 R15.1
P3V3: C40.1 C41.1 C45.2 L10.2 R58.1
VBUS_USB: C1.1 C35.1 C36.1 C37.1 C38.2 D3.2(A) D4.2(A) R53.2 R54.2 R79.2 U14.7(VIN1) U14.8(EN1) U14.10(EN2) U14.11(VIN2)
P1V8_PGOOD: Q2.1(Gate) R54.1 U14.4(PG1) ; off-sheet P1V8_PGOOD
P3V3_PGOOD: Q1.1(Gate) R53.1 U14.13(PG2) ; off-sheet P3V3_PGOOD
NetD3_1: D3.1(C) R16.2
NetD4_1: D4.1(C) R17.2
NetL9_1: L9.1 U14.6(SW1)
NetL10_1: L10.1 U14.12(SW2)
NetQ1_3: Q1.3(Drain) R16.1
NetQ2_3: Q2.3(Drain) R17.1
NetR15_2: R15.2 R56.2 U14.3(FB1)
NetR58_2: R58.2 R77.2 U14.1(FB2)
NetR79_1: R79.1 R97.2 U14.5(MODE/SYNC)
NetR98_2: R98.2 U14.14(COMP/FSET)

### Notes on the sheet
- P1V8 @ 1A / P3V3 @ 3A

### Library data of the parts
C1 C40-C42 C44 = CMP-13271-000002-1: as C58 on sheet 03-8A34004_DPLL-1; Octopart: https://octopart.com/cl05a106mp5nunc-samsung-22457395; Voltage Rating: 10V; RoHS: TRUE; Value: 10uF; Height: 0.7mm; Digikey Description: CAP CER 10UF 10V X5R 0402; Automotive: No; Package: CL05A106MP5NUNC; Device Class L1: Passive Components; Capacitance: 10uF; Temperature Range High: +85°C; ComponentLink2Description: Datasheet; Device Class L2: Capacitors; Temperature Characteristic: X5R; Temperature: -55°C to +85°C; ComponentLink2URL: http://www.samsungsem.com/kr/support/product-search/mlcc/__icsFiles/afieldfile/2019/05/10/19-CL05A106MP5NUNC.pdf; Device Class L3: Ceramic Capacitors; Category: Cap; Temperature Range Low: -55°C; Ipc Land Pattern Name: CAPC10050X50; Lead Free: Yes
C35 = CMP-1034-02068-3: as C29 on sheet 06-RP2040; ComponentLink2URL: https://content.kemet.com/datasheets/KEM_C1002_X7R_SMD.pdf; Automotive: No; Device Class L2: Capacitors; Temperature: -55°C to +125°C; RoHS: TRUE; Voltage Rating: 16 V; ComponentLink2Description: Datasheet; Device Class L3: Ceramic Capacitors; Temperature Range Low: -55°C; Ipc Land Pattern Name: CAPC10050X50; Device Class L1: Passive Components; Temperature Range High: +125°C; Package: C0402-BB; Capacitance: 0.10 μF; Category: Cap; Mouser Description: CAP CER 0.1UF 16V X7R 0402; Height: 0.55mm; Digikey Description: CAP CER 0.1UF 16V 5% X7R 0402; Octopart: https://octopart.com/c0402c104j4ractu-kemet-12573893; Temperature Characteristic: X7R; Lead Free: Yes
C36 C37 = CMP-2000-05997-2: CAP CER 4.7UF 10V X5R 0402; Dielectric Material: Ceramic; Tolerance: 10%; Series: C; Package Quantity: 10000; Max Operating Temperature: 85°C; Case Code (Imperial): 0402; Lead Free: Lead Free; Voltage Rating (DC): 10V; Packaging: Cut Tape; Voltage Rating: 10V; Min Operating Temperature: -55°C; Dielectric: X5R; Thickness: 0.022inch; Width: 0.02inch; Case/Package: 0402; Case Code (Metric): 1005; Capacitance: 4.7uF; Length: 0.039inch; RoHS Compliant: Yes; REACH SVHC: No SVHC; Mount: Surface Mount
C38 C45 C48 = CMP-2000-05441-1: Chip Capacitor, 22 uF, +/- 20%, 10 V, -55 to 85 degC, 0603 (1608 Metric), RoHS, Tape and Reel; Manufacturer: TDK; PCN Part Number: MLCCPartNumberChange30/Nov/2012; Voltage - Rated: 10V; Product Training Modules: CSeriesGeneralApplicationsSEAT,CCV,andTVCLDesignToolsGuidetoReplacinganElectrolyticCapacitorwithanMLCC; Other Names: 445-9077-1; Design Resources: 20WNon-IsolatedBuckLEDDriverUsingPLLNK460KG; Online Catalog: CSeries,GeneralPurpose; Capacitance: 22µF; Temperature Coefficient: X5R; Kits: 445-9014-KIT-ND-KITMLCC100PF-22UF060310-50V; Packaging: CutTape(CT); Standard Package: 1; Package / Case: 0603(1608Metric); Lead Style: -; Features: -; Ratings: -; Operating Temperature: -55degC~85degC; Applications: GeneralPurpose; Package Reference: 603; Datasheet URL: http://download.siliconexpert.com/pdfs/2015/4/21/15/54/45/779/tdk_/manual/37024850441143360mlcc_commercial_general_en.pdf; Datasheet Version: Mar-15; Mounting Type: SurfaceMount,MLCC; Lead Spacing: -; Size / Dimension: 0.063"Lx0.031"W(1.60mmx0.80mm); Height - Seated (Max): -; Package Description: 2-Pin Surface Mount Device, Body 1.6 x 0.8 mm; Manufacturer URL: http://www.tdk.com/; RoHS Information: RoHSCertificate-MLCC; Tolerance: ±20%; Series: C; Thickness (Max): 0.035"(0.90mm); Family: CeramicCapacitors; Category: Capacitors
D3 D4 = CMP-22017-000005-2: as D1 on sheet 03-8A34004_DPLL-1; Min Operating Temperature: -55°C; Lens Style: Clear; Mount: Surface Mount; Width: 0.8mm; Packaging: Tape and Reel; Lens Transparency: Clear; Case Code (Metric): 1608; Depth: 0.8mm; Case Code (Imperial): 0603; Case/Package: 0603; Number of Pins: 2; Max Operating Temperature: 85°C; Lead Free: Lead Free; Number of Elements: 1; Length: 1.6mm; Height: 0.8mm; Package Quantity: 1; Power Rating: 100mW; Radiation Hardening: No; Illumination Color: Green; Color: Green
L9 L10 = CMP-06042-015149-1: Shielded Wirewound Inductor 0.47uH 20% 4000mA 0.027Ω 1008 (2520)
Q1 Q2 = CMP-1058-00766-2: MOSFET N-CH 60V 320MA SOT-23; Max Power Dissipation: 420mW; Nominal Vgs: 2.3V; Fall Time: 9ns; Turn-Off Delay Time: 55.8ns; Number of Elements: 1; Rds On Max: 1.6R; Input Capacitance: 24.5pF; Turn-On Delay Time: 12.2ns; Element Configuration: Single; Gate to Source Voltage (Vgs): 20V; Power Dissipation: 300mW; Width: 1.4mm; Halogen Free: Halogen Free; Packaging: Tape and Reel; Radiation Hardening: No; Rise Time: 9ns; Case/Package: SOT-23-3; Number of Pins: 3; Min Operating Temperature: -55°C; REACH SVHC: No SVHC; Max Operating Temperature: 150°C; Height: 1.01mm; Length: 3.04mm; Contact Plating: Tin; Continuous Drain Current (ID): 320mA; Drain to Source Breakdown Voltage: 60V; Lead Free: Lead Free; Drain to Source Resistance: 1.6R; Threshold Voltage: 2.3V; Package Quantity: 1; On-State Resistance: 1.6R
R15 = CMP-2002-05709-1: Manufacturer: TE Connectivity / AMP; Part Number: CRG0402F20K
R16 R17 = CMP-2002-05853-1: as R71 on sheet 03-8A34004_DPLL-1
R53 R54 R56 R77 = CMP-2002-04694-1: as R9 on sheet 06-RP2040
R58 = CMP-1011-00697-1: 45K3 0.063W 1% 0402 (1005 Metric)  SMD; Case-EIA: 0402; Case-Metric: 1005; Value: 45300.00 Ohm; Technology: SMT; Tolerance: 1 %; Power: 0.063 W
R79 R97 = CMP-2002-06457-1: as R33 on sheet 03-8A34004_DPLL-1
R98 = CMP-2002-00253-3: Chip Resistor, 8.06 KOhm, +/- 1%, 63 mW, -55 to 155 degC, 0402 (1005 Metric), RoHS, Tape and Reel; PartNumber: CRCW04028K06FKED; Manufacturer: Basic Passives; Case\/Package: 0402; Power Rating: 63 mW; Voltage Rating: 50 V; PackageReference: 0402; Radiation Hardening: No; Package Quantity: 10000; Height: 0.35 mm; Packaging: Tape and Reel; Mount: Surface Mount; Length: 1 mm; Weight: 2.3E-05oz; Case Code (Metric): 1005; DatasheetVersion: 06/2012; Pins: 2; Min Operating Temperature: -55 degC; Case Code (Imperial): 0402; REACH SVHC: Unknown; Tolerance: 1%; Mounting Technology: Surface Mount; ComponentLink1URL: http://www.vishay.com/; ComponentLink2URL: http://www.vishay.com/docs/20035/dcrcwe3.pdf; ComponentLink2Description: Datasheet; Resistance: 8.06 KOhm; Max Operating Temperature: 155 degC; ComponentLink1Description: Manufacturer URL; Width: 0.5 mm; RoHSCompliant: true; PackageDescription: 2-Pin Surface Mount Device, Body 1 x 0.5 mm
U14 = CMP-04918-000654-1: Adjustable-Frequency Dual Step-Down Converter, 2.7-6V VIN, 0.6-5.5V 2A VOUT, VQFN-HR14

## Nets that join several sheets
GND: 03-8A34004_DPLL-1 (20 pins), 05-TCXO_Crystal (12 pins), 06-RP2040 (24 pins), 08-Power (19 pins)
P3V3: 03-8A34004_DPLL-1 (13 pins), 05-TCXO_Crystal (10 pins), 06-RP2040 (24 pins), 08-Power (5 pins)
DPLL_CLKIN1_P: 03-8A34004_DPLL-1 (R36.1), 06-RP2040 (U7.13)
DPLL_CLKOUT8_P: 03-8A34004_DPLL-1 (R39.2), 06-RP2040 (U7.3)
DPLL_CLKOUT9_P: 03-8A34004_DPLL-1 (R40.2), 06-RP2040 (U7.8)
DPLL_CLKOUT10_P: 03-8A34004_DPLL-1 (R41.2), 06-RP2040 (U7.9)
DPLL_CLKOUT11_P: 03-8A34004_DPLL-1 (R42.2), 06-RP2040 (U7.7)
DPLL_CS: 03-8A34004_DPLL-1 (R46.1 U11.9), 06-RP2040 (U7.12)
DPLL_GPIO2: 03-8A34004_DPLL-1 (U11.29), 06-RP2040 (U7.18)
DPLL_GPIO3: 03-8A34004_DPLL-1 (U11.19), 06-RP2040 (U7.17)
DPLL_GPIO4: 03-8A34004_DPLL-1 (U11.37), 06-RP2040 (U7.16)
DPLL_GPIO5: 03-8A34004_DPLL-1 (U11.36), 06-RP2040 (U7.15)
DPLL_OSCI: 03-8A34004_DPLL-1 (U11.45), 05-TCXO_Crystal (C21.2)
DPLL_RST_N: 03-8A34004_DPLL-1 (R31.1 U11.17), 06-RP2040 (U7.28)
DPLL_SCLK: 03-8A34004_DPLL-1 (R49.1 U11.12), 06-RP2040 (U7.5)
DPLL_SDI: 03-8A34004_DPLL-1 (R45.1 U11.10), 06-RP2040 (U7.14)
DPLL_SDIO: 03-8A34004_DPLL-1 (R50.1 U11.11), 06-RP2040 (U7.4)
SiT5501_PLL_SCL: 05-TCXO_Crystal (R96.1 Y4.3), 06-RP2040 (U7.30)
SiT5501_PLL_SDA: 05-TCXO_Crystal (R95.1 Y4.2), 06-RP2040 (U7.29)
TCXO_10M: 03-8A34004_DPLL-1 (U11.1), 05-TCXO_Crystal (R26.1)

## Assembly variants
845-XXXXX_PCBA_projectname: all parts fitted